# EAGLE design LM encoder board (EAGLE 6.2)
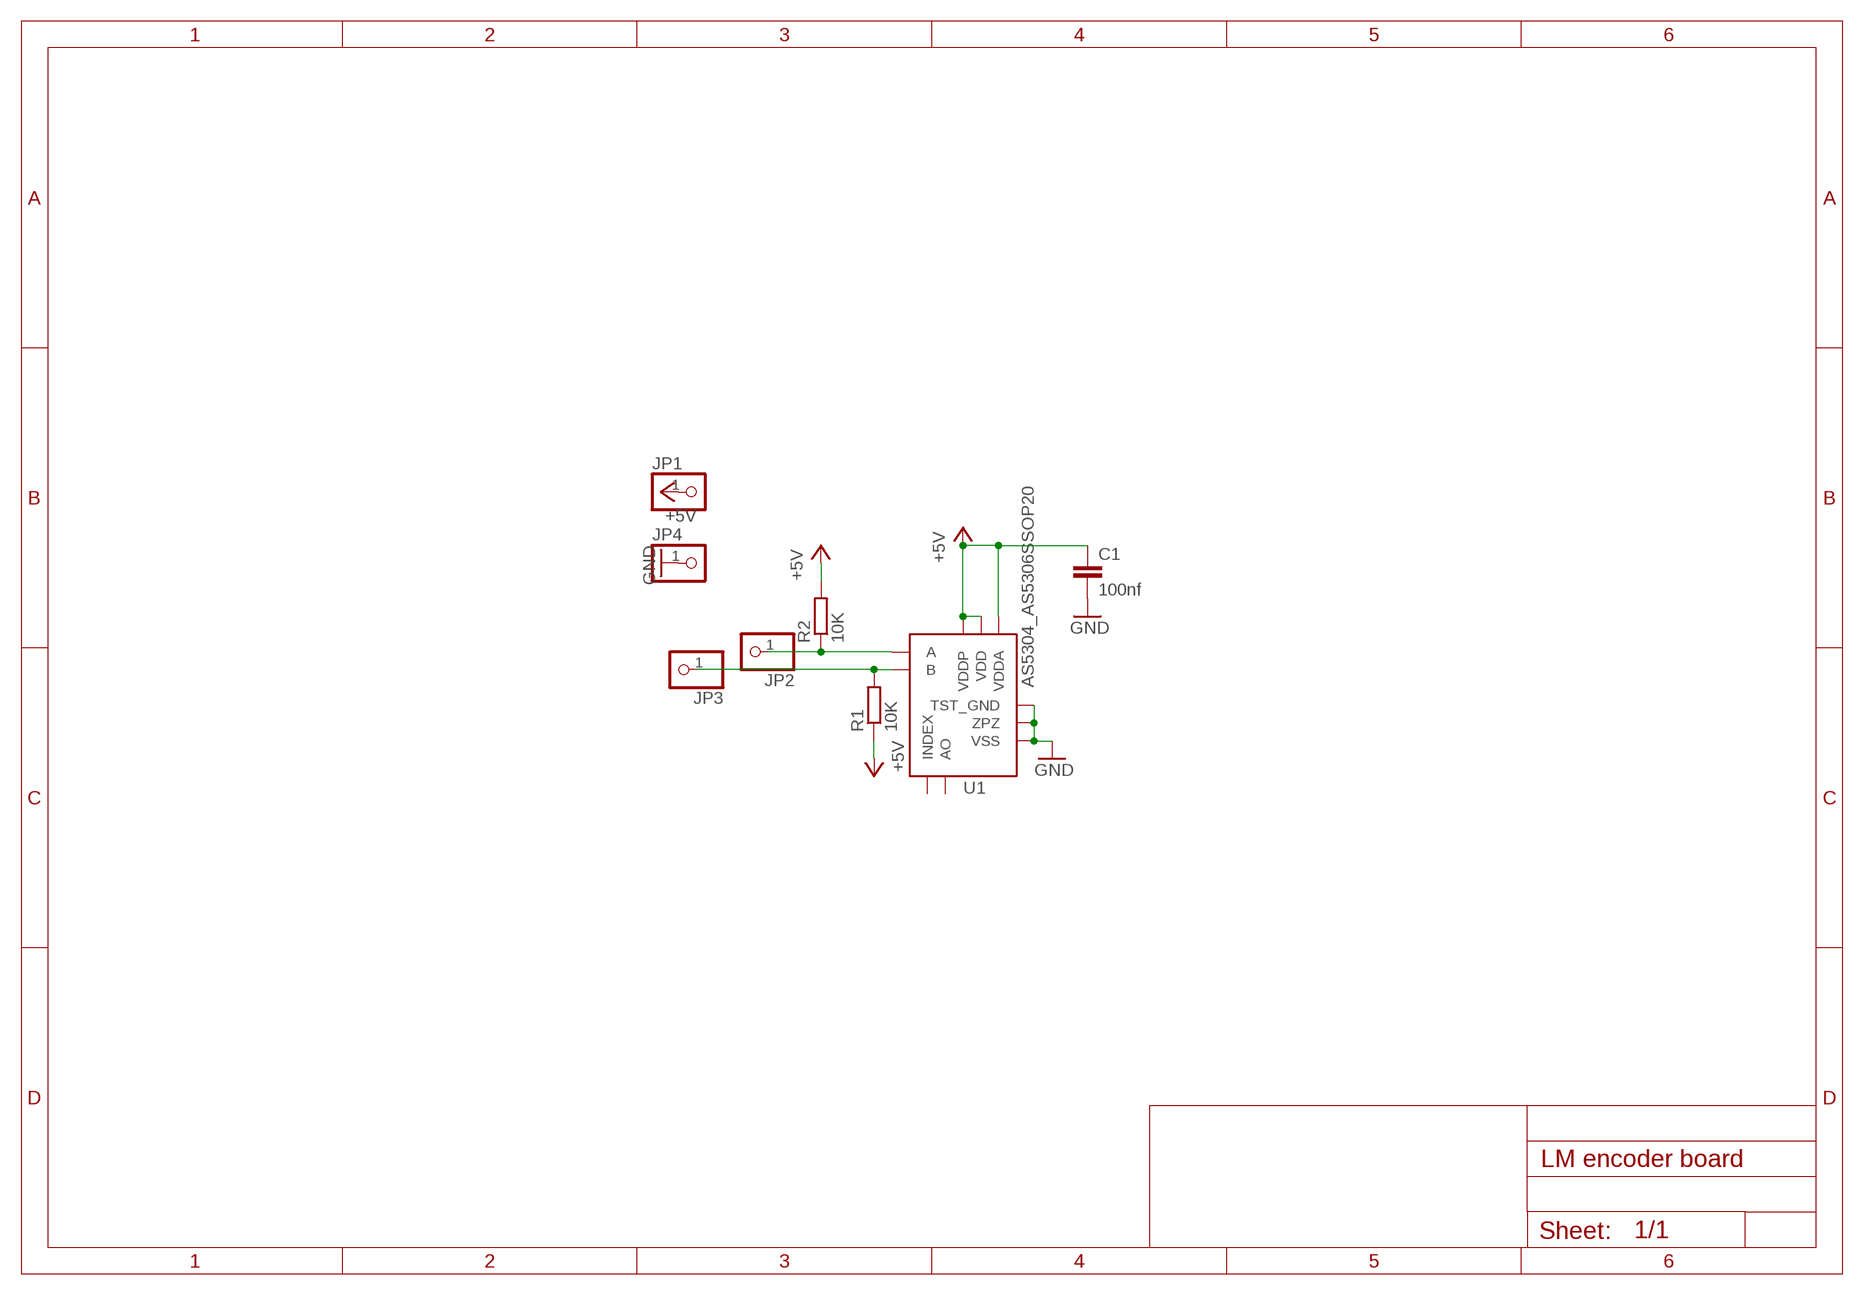
[diagram p0: schematic, sheet 1]

## Parts
C1  100nf  C-EUC0805  [C0805]
JP1  PINHD-1X1CB  [1X01-CLEANBIG]
JP2  PINHD-1X1CB  [1X01-CLEANBIG]
JP3  PINHD-1X1CB  [1X01-CLEANBIG]
JP4  PINHD-1X1CB  [1X01-CLEANBIG]
R1  10K  R-EU_M0805  [M0805]
R2  10K  R-EU_M0805  [M0805]
U1  AS5304_AS5306SSOP20  [AS5304_5306]

## Nets
+5V: C1.1 JP1.1 R1.1 R2.2 U1.3(VDDP) U1.7(VDD) U1.16(VDDA)
GND: C1.2 JP4.1 U1.1(VSS) U1.15(TST_GND) U1.20(ZPZ)
N$1: JP2.1 R2.1 U1.2(A)
N$2: JP3.1 R1.2 U1.4(B)
Unconnected: U1.6(AO) U1.8(INDEX)

## Library data of the parts
C1 = resistor:C-EU: CAPACITOR, European symbol
JP1-JP4 = adafruit:PINHD-1X1: Pin header 1x1 for 0.1" spacing With round pins
R1 R2 = resistor:R-EU_: RESISTOR, European symbol
U1 = AMS AS5304_5306:AS5304_AS5306: The AS5304 is a linear magnetic encoder with a resolution of 2.0mm per pole and a push-pull output. The AS5306 is a linear magnetic encoder with a resolution of 1.2mm per pole and an open drain output. Pullup resistors are required on the A, B and Index outputs of the AS5306 only.

## Board
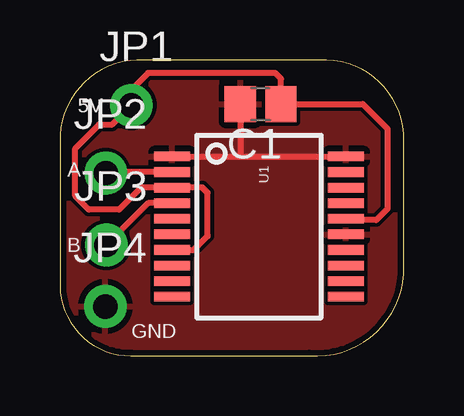
[diagram p1: board, top side]
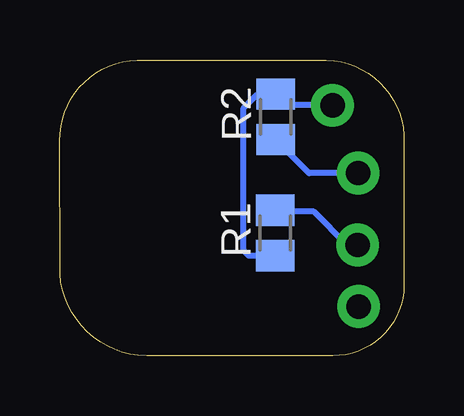
[diagram p2: board, bottom side, seen from below]

Size 14.35 x 12.35 mm. Coordinates in mm from the lower left corner, seen from the top.
Outline: 3.53,12.35 arc90 0,9.21 0,2.96 arc90 2.97,0.01 10.4,0.01 arc90 14.35,3.42 14.35,8.97 arc90 11.12,12.34 3.53,12.35
Copper layers (1*16): Top 0.035mm / dielectric 1.5mm / Bottom 0.035mm
Design rules: minimum track width 6mil, minimum drill 12mil, track to track 6mil, track to pad 6mil, pad to pad 6mil, via to via 6mil, smd to smd 0mil, copper to edge 10mil, drill to drill 10mil, minimum pad ring 10mil, minimum via ring 6mil, stop-mask expansion 2mil, vias tented up to drill 100mil, thermal gap 10mil

### Footprints (pad centres in the part's own frame; a part is rotated, then mirrored left to right if it is on the bottom)
C0805 = smd 1.3 x 1.5: 1 -0.85,0; 2 0.85,0
1X01-CLEANBIG = drill 1.016 pad 1.778: 1 0,0
M0805 = smd 1.3 x 1.6: 1 -0.95,0; 2 0.95,0
AS5304_5306 = smd 0.4 x 1.5: 1 -2.925,-3.625; 2 -2.275,-3.625; 3 -1.625,-3.625; 4 -0.975,-3.625; 5 -0.325,-3.625; 6 0.325,-3.625; 7 0.975,-3.625; 8 1.625,-3.625; 9 2.275,-3.625; 10 2.925,-3.625; 11 2.925,3.625; 12 2.275,3.625; 13 1.625,3.625; 14 0.975,3.625; 15 0.325,3.625; 16 -0.325,3.625; 17 -0.975,3.625; 18 -1.625,3.625; 19 -2.275,3.625; 20 -2.925,3.625

### Placement (x,y rotation side)
C1  8.37,10.51 180 top
JP1  2.98,10.46 0 top
JP2  1.91,7.63 0 top
JP3  1.93,4.63 0 top
JP4  1.89,2.07 0 top
R1  5.37,5.14 90 bottom
R2  5.35,9.98 90 bottom
U1  8.3,5.4 270 top

### Tracks (layer width: path | path; a pad name or v marks a point on that pad's centre or on a via)
+5V
  Top 0.254: U1.16 11.99,5.67 13.19,5.67 13.66,6.14 13.66,9.48 12.63,10.51 C1.1 9.22,11.57 8.99,11.8 3.67,11.8 3.07,11.2 3.07,10.54 JP1.1 2.18,9.66 1.63,9.66 0.64,8.66 0.64,6.67 1.2,6.11 2.46,6.11 3.39,7.03 4.16,7.03 5.95,7.03 6.16,6.82 6.16,5.04 6.12,5 6.12,4.97 5.58,4.43 | U1.7 5.58,4.43 | 5.58,4.43 6.16,5.01 6.16,6.8 5.93,7.03 U1.3 | 5.58,4.43
  Bottom 0.254: JP1.1 4.88,10.46 R2.2 5.38,10.9 6.14,10.9 6.69,10.35 6.69,4.4 6.47,4.19 R1.1
GND
  Top 0.254: U1.1 7.4,8.33 | 7.4,8.33 U1.20 | C1.2 7.52,8.44 7.4,8.33
  pour Top: 17.02,12.58 17.02,-0.52 -0.45,-0.52 -0.45,12.65
N$1
  Top 0.254: U1.2 1.95,7.68 JP2.1
  Bottom 0.254: JP2.1 3.96,7.63 R2.1
N$2
  Top 0.254: U1.4 3.67,6.38 JP3.1
  Bottom 0.254: JP3.1 2.37,4.63 3.76,6.03 5.32,6.03 R1.2

### Text on the board
tPlace: 5V | A | B | GND